# EAGLE design magnes (EAGLE 9.5.1)
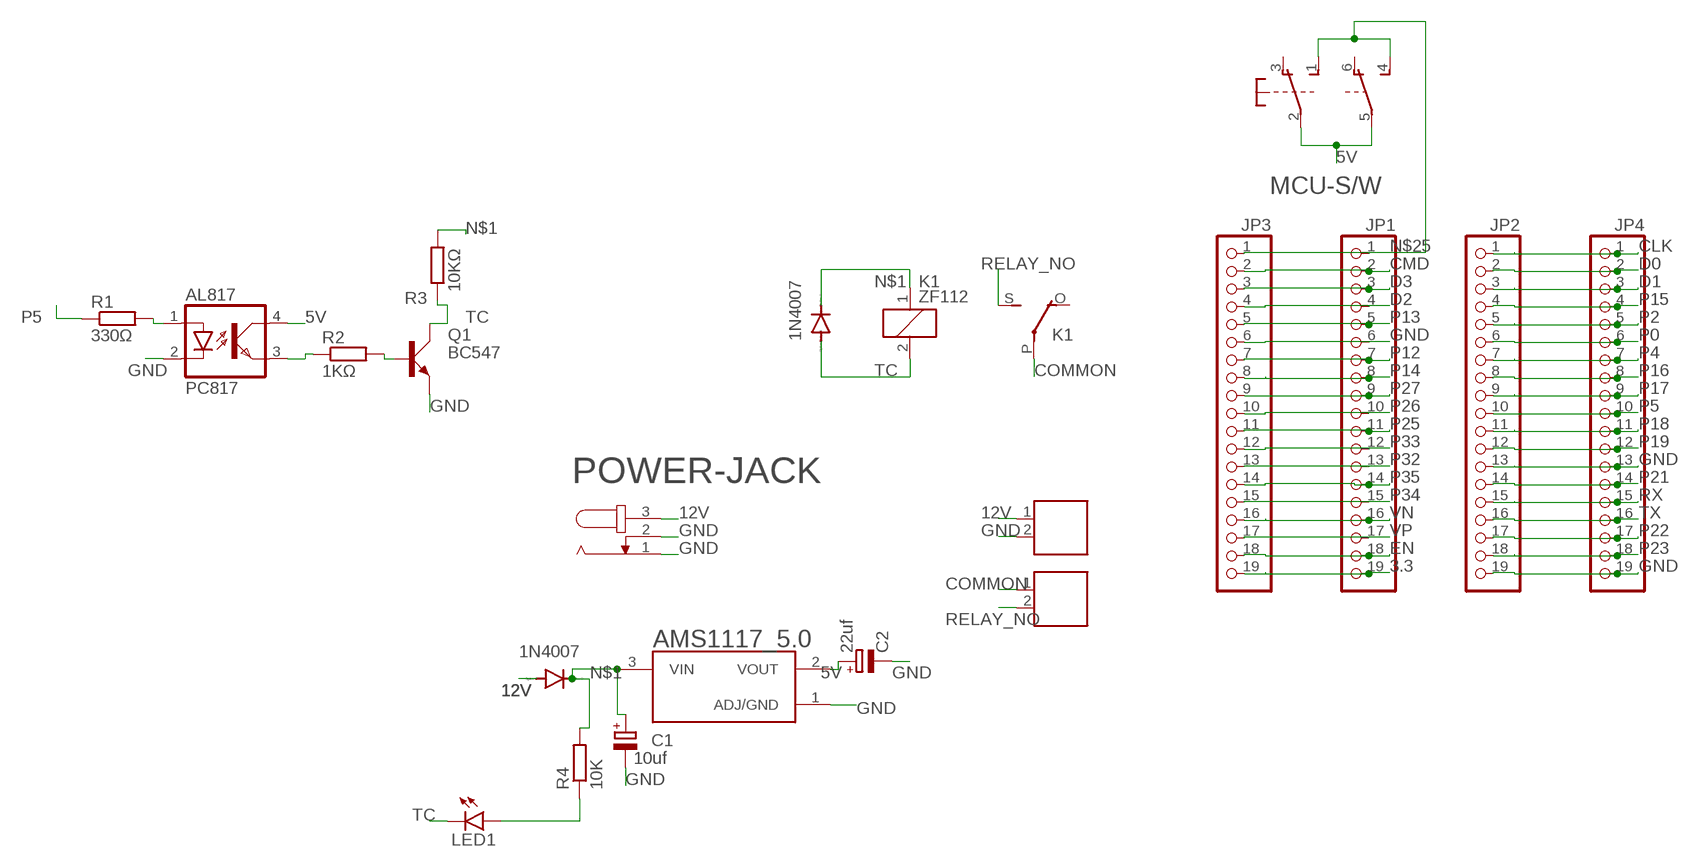
[diagram p0: schematic, sheet 1]

## Parts
1N1  1N4007  DIODE-D-7.5  [D-7.5]
1N4007  DIODE-D-7.5  [D-7.5]
AL817  PC817  [DIL04]
AMS1117_5.0  AMS1117-3.3  [SOT229P700X180-4N]
C1  10uf  CPOL-EUE2.5-6  [E2,5-6]
C2  22uf  CPOL-EUE2.5-6  [E2,5-6]
JP1  PINHD-1X19  [1X19]
JP2  PINHD-1X19  [1X19]
JP3  PINHD-1X19  [1X19]
JP4  PINHD-1X19  [1X19]
K1  ZF112  [ZF112]
LED1  LED3MM  [LED3MM]
MCU-S/W  9077-2  [9077-2]
PCBSCREWTERMINAL  691131710002  [691131710002]
PCBSCREWTERMINAL1  691131710002  [691131710002]
POWER-JACK  JACK-PLUG1  [SPC4078]
Q1  BC547  [SOT54A]
R1  330Ω  R-EU_0204/7  [0204/7]
R2  1KΩ  R-EU_0204/7  [0204/7]
R3  10KΩ  R-EU_0204/7  [0204/7]
R4  10K  R-EU_0204/7  [0204/7]

## Nets
3.3: JP1.19 JP3.19
5V: AL817.4(COL) AMS1117_5.0.2(VOUT) C2.+ MCU-S/W.2(1:P) MCU-S/W.5(2:P)
12V: 1N4007.A PCBSCREWTERMINAL.1 POWER-JACK.3
CLK: JP2.1 JP4.1
CMD: JP1.2 JP3.2
COMMON: K1.P(2:P) PCBSCREWTERMINAL1.1
D0: JP2.2 JP4.2
D1: JP2.3 JP4.3
D2: JP1.4 JP3.4
D3: JP1.3 JP3.3
EN: JP1.18 JP3.18
GND: AL817.2(C) AMS1117_5.0.1(ADJ/GND) C1.- C2.- JP1.6 JP2.13 JP2.19 JP3.6 JP4.13 JP4.19 PCBSCREWTERMINAL.2 POWER-JACK.1 POWER-JACK.2 Q1.E
N$1: 1N1.C 1N4007.C AMS1117_5.0.3(VIN) C1.+ K1.1 R3.2 R4.2
N$2: Q1.B R2.2
N$3: AL817.1(A) R1.2
N$5: AL817.3(EMIT) R2.1
N$6: LED1.A R4.1
N$25: JP1.1 JP3.1 MCU-S/W.1(1:S) MCU-S/W.4(2:S)
P0: JP2.6 JP4.6
P2: JP2.5 JP4.5
P4: JP2.7 JP4.7
P5: JP2.10 JP4.10 R1.1
P12: JP1.7 JP3.7
P13: JP1.5 JP3.5
P14: JP1.8 JP3.8
P15: JP2.4 JP4.4
P16: JP2.8 JP4.8
P17: JP2.9 JP4.9
P18: JP2.11 JP4.11
P19: JP2.12 JP4.12
P21: JP2.14 JP4.14
P22: JP2.17 JP4.17
P23: JP2.18 JP4.18
P25: JP1.11 JP3.11
P26: JP1.10 JP3.10
P27: JP1.9 JP3.9
P32: JP1.13 JP3.13
P33: JP1.12 JP3.12
P34: JP1.15 JP3.15
P35: JP1.14 JP3.14
RELAY_NO: K1.S(2:S) PCBSCREWTERMINAL1.2
RX: JP2.15 JP4.15
TC: 1N1.A K1.2 LED1.K(C) Q1.C R3.1
TX: JP2.16 JP4.16
VN: JP1.16 JP3.16
VP: JP1.17 JP3.17
Unconnected: K1.O(2:O) MCU-S/W.3(1:O) MCU-S/W.6(2:O)

## Library data of the parts
1N1 1N4007 = diode:DIODE-: DIODE
AL817 = optocoupler:PC817: SHARP OPTO COUPLER; MPN: PC817X4J000F; OC_FARNELL: 9707727; OC_NEWARK: 97K7059
AMS1117_5.0 = AMS1117-3.3:AMS1117-3.3: Sot223/Pkg 1-Amp 3.3-Volt Low Drop Out Voltage Regulatator; AVAILABILITY: Unavailable; DESCRIPTION: Sot223/Pkg 1-Amp 3.3-Volt Low Drop Out Voltage Regulatator; MF: Advanced Monolithic Systems; MP: AMS1117-3.3; PACKAGE: None; PRICE: None
C1 C2 = rcl:CPOL-EU: POLARIZED CAPACITOR, European symbol; SPICEPREFIX: C
JP1-JP4 = pinhead:PINHD-1X19: PIN HEADER
K1 = relay:ZF112: RELAY 1 x switch; OC_FARNELL: unknown; OC_NEWARK: unknown
LED1 = led:LED: LED OSRAM: - CHIPLED LG R971, LG N971, LY N971, LG Q971, LY Q971, LO R971, LY R971 LH N974, LH R974 LS Q976, LO Q976, LY Q976 LO Q996 - Hyper CHIPLED LW Q18S LB Q993, LB Q99A, LB R99A - SideLED LS A670, LO A670, LY A670, LG A670, LP A670 LB A673, LV A673, LT A673, LW A673 LH A674 LY A675 LS A676, LA A676, LO A676, LY A676, LW A676 LS A679, LY A679, LG A679 - Hyper Micro SIDELED® LS Y876, LA Y876, LO Y876, LY Y876 LT Y87S - SmartLED LW L88C, LW L88S LB L89C, LB L89S, LG L890 LS L89K, LO L89K, LY L89K LS L896, LA L896, LO L896, LY L896 - TOPLED LS T670, LO T670, LY T670, LG T670, LP T670 LSG T670, LSP T670, LSY T670, LOP T670, LYG T670 LG T671, LOG T671, LSG T671 LB T673, LV T673, LT T673, LW T673 LH T674 LS T676, LA T676, LO T676, LY T676, LB T676, LH T676, LSB T676, LW T676 LB T67C, LV T67C, LT T67C, LS T67K, LO T67K, LY T67K, LW E67C LS E67B, LA E67B, LO E67B, LY E67B, LB E67C, LV E67C, LT E67C LW T67C LS T679, LY T679, LG T679 LS T770, LO T770, LY T770, LG T770, LP T770 LB T773, LV T773, LT T773, LW T773 LH T774 LS E675, LA E675, LY E675, LS T675 LS T776, LA T776, LO T776, LY T776, LB T776 LHGB T686 LT T68C, LB T68C - Hyper Mini TOPLED® LB M676 - Mini TOPLED Santana® LG M470 LS M47K, LO M47K, LY M47K Source: http://www.osram.convergy.de LUXEON: - LUMILED® LXK2-PW12-R00, LXK2-PW12-S00, LXK2-PW14-U00, LXK2-PW14-V00 LXK2-PM12-R00, LXK2-PM12-S00, LXK2-PM14-U00 LXK2-PE12-Q00, LXK2-PE12-R00, LXK2-PE12-S00, LXK2-PE14-T00, LXK2-PE14-U00 LXK2-PB12-K00, LXK2-PB12-L00, LXK2-PB12-M00, LXK2-PB14-N00, LXK2-PB14-P00, LXK2-PB14-Q00 LXK2-PR12-L00, LXK2-PR12-M00, LXK2-PR14-Q00, LXK2-PR14-R00 LXK2-PD12-Q00, LXK2-PD12-R00, LXK2-PD12-S00 LXK2-PH12-R00, LXK2-PH12-S00 LXK2-PL12-P00, LXK2-PL12-Q00, LXK2-PL12-R00 Source: www.luxeon.com KINGBRIGHT: KA-3528ASYC Source: www.kingbright.com
MCU-S/W = switch-misc:9077-2: MARQUARDT SWITCH 9077.0200 Distributor: Buerklin <https://www.buerklin.com/default.asp?event=ShowArtikel%2812G2822%29&l=d&jump=ArtNr_12G2822>
PCBSCREWTERMINAL PCBSCREWTERMINAL1 = Wurth_Elektronik_Electromechanic_Terminal_Blocks_Connectors_rev16b:691131710002: WR-TBL Terminal block - CUU5/2 CUU5/2GR - 2 Pins;=>Code : Con_TBL_Screw_PClamp_5.00_6911317100xx_691131710002 <http://katalog.we-online.de/media/images/eican/Con_TBL_Screw_PClamp_5.00_6911317100xx_pf2.jpg> Details see: http://katalog.we-online.de/em/datasheet/6911317100xx.pdf Created 11/23/2014, Karrer Zheng 2014 (C) Wurth Elektronik
POWER-JACK = con-jack:JACK-PLUG: DC POWER JACK Power Jack, DC, Right Angle, Through Hole, Rated 5A at 16VDC, PC Terminals Distributor: Farnell (www.Farnell.de) Drawing: 84N1161.pdf / 84N1162.pdf Manufacturer: SPC Technology (www.spctechnology.com) Type: SPC4077 / SPC 4078; OC_FARNELL: unknown; OC_NEWARK: unknown
Q1 = transistor-small-signal:BC547: NPN TRANSISTOR
R1-R4 = rcl:R-EU_: RESISTOR, European symbol; SPICEPREFIX: R

## Board
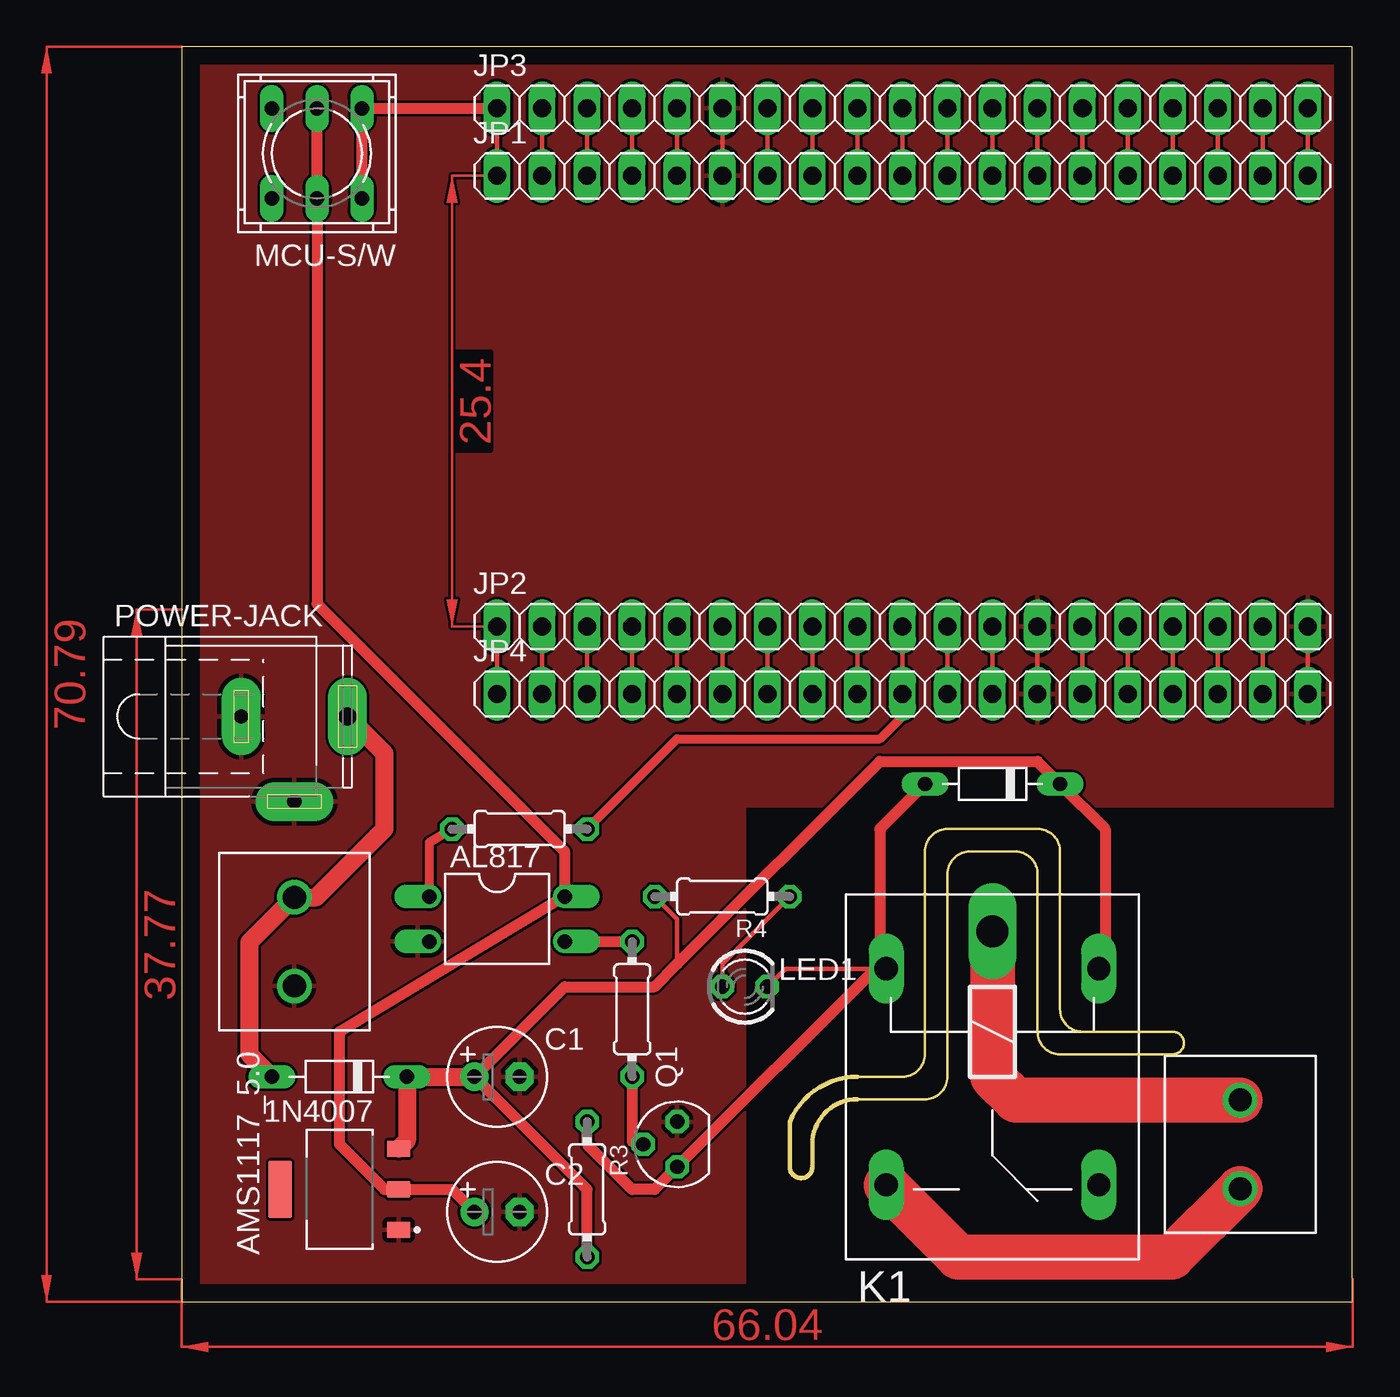
[diagram p1: board, top side]

Size 66.02 x 70.79 mm. Coordinates in mm from the lower left corner, seen from the top.
Outline: 0,0 66.02,0 66.02,70.79 0,70.79 0,0
Outline: 41.91,25.4 41.91,13.97 arc-90 40.64,12.7 38.1,12.7 arc67 34.29,10.16 34.29,7.62 arc180 35.56,7.62 35.56,8.89 arc-90 38.1,11.43 41.91,11.43 arc90 43.18,12.7 43.18,24.13 arc-90 44.45,25.4 46.99,25.4 arc-90 48.26,24.13 48.26,15.24 arc90 49.53,13.97 55.88,13.97 arc180 55.88,15.24 50.8,15.24 arc-90 49.53,16.51 49.53,25.4 arc90 48.26,26.67 43.18,26.67 arc90 41.91,25.4
Copper layers (1*16): Top 0.035mm / dielectric 1.5mm / Bottom 0.035mm
Design rules "default": minimum track width 6mil, minimum drill 0.35mm, track to track 6mil, track to pad 6mil, pad to pad 6mil, via to via 6mil, smd to smd 6mil, copper to edge 40mil, drill to drill 6mil, minimum pad ring 10mil, minimum via ring 8mil, stop-mask expansion 4mil, vias tented up to drill 0mil, thermal gap 10mil

### Footprints (pad centres in the part's own frame; a part is rotated, then mirrored left to right if it is on the bottom)
D-7.5 = drill 0.813 long: A 3.81,0; C -3.81,0
DIL04 = drill 0.813 offset: 1 -1.27,-3.81; 2 1.27,-3.81; 3 1.27,3.81; 4 -1.27,3.81
SOT229P700X180-4N = smd 0.93 x 1.31: 1 -2.29,-3.345; 2 0,-3.345; 3 2.29,-3.345 | smd 3.24 x 1.31: 4 0,3.345
E2,5-6 = drill 0.813 pad 1.6: + -1.27,0 | drill 0.813 pad 1.6 octagon: - 1.27,0
1X19 = drill 1.016 long: 1 -22.86,0; 2 -20.32,0; 3 -17.78,0; 4 -15.24,0; 5 -12.7,0; 6 -10.16,0; 7 -7.62,0; 8 -5.08,0; 9 -2.54,0; 10 0,0; 11 2.54,0; 12 5.08,0; 13 7.62,0; 14 10.16,0; 15 12.7,0; 16 15.24,0; 17 17.78,0; 18 20.32,0; 19 22.86,0
ZF112 = drill 1.321 long: 1 -6.096,5.994; 2 -6.096,-5.994; O 6.096,5.994; S 6.096,-5.994 | drill 1.803 long: P -8.204,0
LED3MM = drill 0.813 octagon: A -1.27,0; K 1.27,0
9077-2 = drill 0.813 long: 1 -2.54,2.54; 2 0,2.54; 3 2.54,2.54; 4 -2.54,-2.54; 5 0,-2.54; 6 2.54,-2.54
691131710002 = drill 1.3: 1 -2.5,0; 2 2.5,0
SPC4078 = drill 0.8 pad 2.184 long: 1 -3,0; 2 0,-4.8 | drill 1 pad 2.184 long: 3 3,0
SOT54A = drill 0.813 octagon: B 0,1.905; C -1.27,0; E 1.27,0
0204/7 = drill 0.813 octagon: 1 -3.81,0; 2 3.81,0

### Placement (x,y rotation side)
1N1  45.72,29.21 180 top
1N4007  8.89,12.7 180 top
AL817  17.78,21.59 270 top
AMS1117_5.0  8.89,6.35 90 top
C1  17.78,12.7 0 top
C2  17.78,5.08 0 top
JP1  40.64,63.5 0 top
JP2  40.64,38.1 0 top
JP3  40.64,67.31 0 top
JP4  40.64,34.29 0 top
K1  45.72,12.7 270 top
LED1  31.75,17.78 0 top
MCU-S/W  7.62,64.77 180 top
PCBSCREWTERMINAL  6.35,20.32 270 top
PCBSCREWTERMINAL1  59.69,8.89 270 top
POWER-JACK  6.35,33.02 0 top
Q1  27.94,8.89 90 top
R1  19.05,26.67 180 top
R2  25.4,16.51 270 top
R3  22.86,6.35 270 top
R4  30.48,22.86 180 top

### Tracks (layer width: path | path; a pad name or v marks a point on that pad's centre or on a via)
3.3
  Top 0.254: JP3.19 JP1.19
5V
  Top 0.61: C2.+ 15.24,6.35 AMS1117_5.0.2 11.43,6.35 8.89,8.89 8.89,15.24 AL817.4 21.59,25.4 7.62,39.37 MCU-S/W.2 MCU-S/W.5
12V
  Top 1.016: POWER-JACK.3 11.43,30.94 11.43,26.67 7.58,22.82 PCBSCREWTERMINAL.1 3.81,20.28 3.81,13.97 1N4007.A
CLK
  Top 0.254: JP2.1 JP4.1
CMD
  Top 0.254: JP3.2 JP1.2
COMMON
  Top 2.54: K1.P 45.72,12.7 47.03,11.39 PCBSCREWTERMINAL1.1
D0
  Top 0.254: JP2.2 JP4.2
D1
  Top 0.254: JP2.3 JP4.3
D2
  Top 0.254: JP3.4 JP1.4
D3
  Top 0.254: JP3.3 JP1.3
EN
  Top 0.254: JP3.18 JP1.18
GND
  Top 0.254: JP3.6 JP1.6 | JP2.13 JP4.13 | JP2.19 JP4.19
  pour Top: 0,71.12 66.04,71.12 66.04,69.85 66.04,27.94 31.75,27.94 31.75,0 0,0
N$1
  Top 0.254: R4.2 27.94,21.59 27.94,19.05
  Top 0.61: R3.2 22.86,6.35 C1.+ 21.59,17.78 26.67,17.78 27.94,19.05 39.37,30.48 48.26,30.48 1N1.C 52.07,26.67 52.07,19.15 K1.1
  Top 1.016: C1.+ 1N4007.C 12.7,9.1 AMS1117_5.0.3
N$2
  Top 0.61: Q1.B 25.4,9.05 R2.2
N$3
  Top 0.508: R1.2 13.97,25.91 AL817.1
N$5
  Top 0.61: AL817.3 R2.1
N$6
  Top 0.254: R4.1 30.48,19.05 LED1.A
N$25
  Top 0.254: JP3.1 JP1.1
  Top 0.61: MCU-S/W.1 MCU-S/W.4 17.42,67.31 17.6,67.13 JP3.1
P0
  Top 0.254: JP2.6 JP4.6
P2
  Top 0.254: JP2.5 JP4.5
P4
  Top 0.254: JP2.7 JP4.7
P5
  Top 0.254: JP2.10 JP4.10
  Top 0.508: R1.1 27.94,31.75 39.37,31.75 40.64,33.02 JP4.10
P12
  Top 0.254: JP3.7 JP1.7
P13
  Top 0.254: JP3.5 JP1.5
P14
  Top 0.254: JP3.8 JP1.8
P15
  Top 0.254: JP2.4 JP4.4
P16
  Top 0.254: JP2.8 JP4.8
P17
  Top 0.254: JP2.9 JP4.9
P18
  Top 0.254: JP2.11 JP4.11
P19
  Top 0.254: JP2.12 JP4.12
P21
  Top 0.254: JP2.14 JP4.14
P22
  Top 0.254: JP2.17 JP4.17
P23
  Top 0.254: JP2.18 JP4.18
P25
  Top 0.254: JP3.11 JP1.11
P26
  Top 0.254: JP3.10 JP1.10
P27
  Top 0.254: JP3.9 JP1.9
P32
  Top 0.254: JP3.13 JP1.13
P33
  Top 0.254: JP3.12 JP1.12
P34
  Top 0.254: JP3.15 JP1.15
P35
  Top 0.254: JP3.14 JP1.14
RELAY_NO
  Top 2.54: K1.S 43.79,2.54 55.84,2.54 PCBSCREWTERMINAL1.2
RX
  Top 0.254: JP2.15 JP4.15
TC
  Top 0.254: LED1.K 34.04,18.8 39.37,18.8 K1.2
  Top 0.61: R3.1 22.86,8.89 25.4,6.35 26.67,6.35 Q1.C 39.12,18.8 39.37,18.8 | 1N1.A 39.37,26.67 39.37,19.15 K1.2
TX
  Top 0.254: JP2.16 JP4.16
VN
  Top 0.254: JP3.16 JP1.16
VP
  Top 0.254: JP3.17 JP1.17
(copper drawn outside any net)
  shapes: Top area x4